# Altium schematic sheet Sheet1.SchDoc
size A1; SheetNumber: 2; SheetTotal: 4
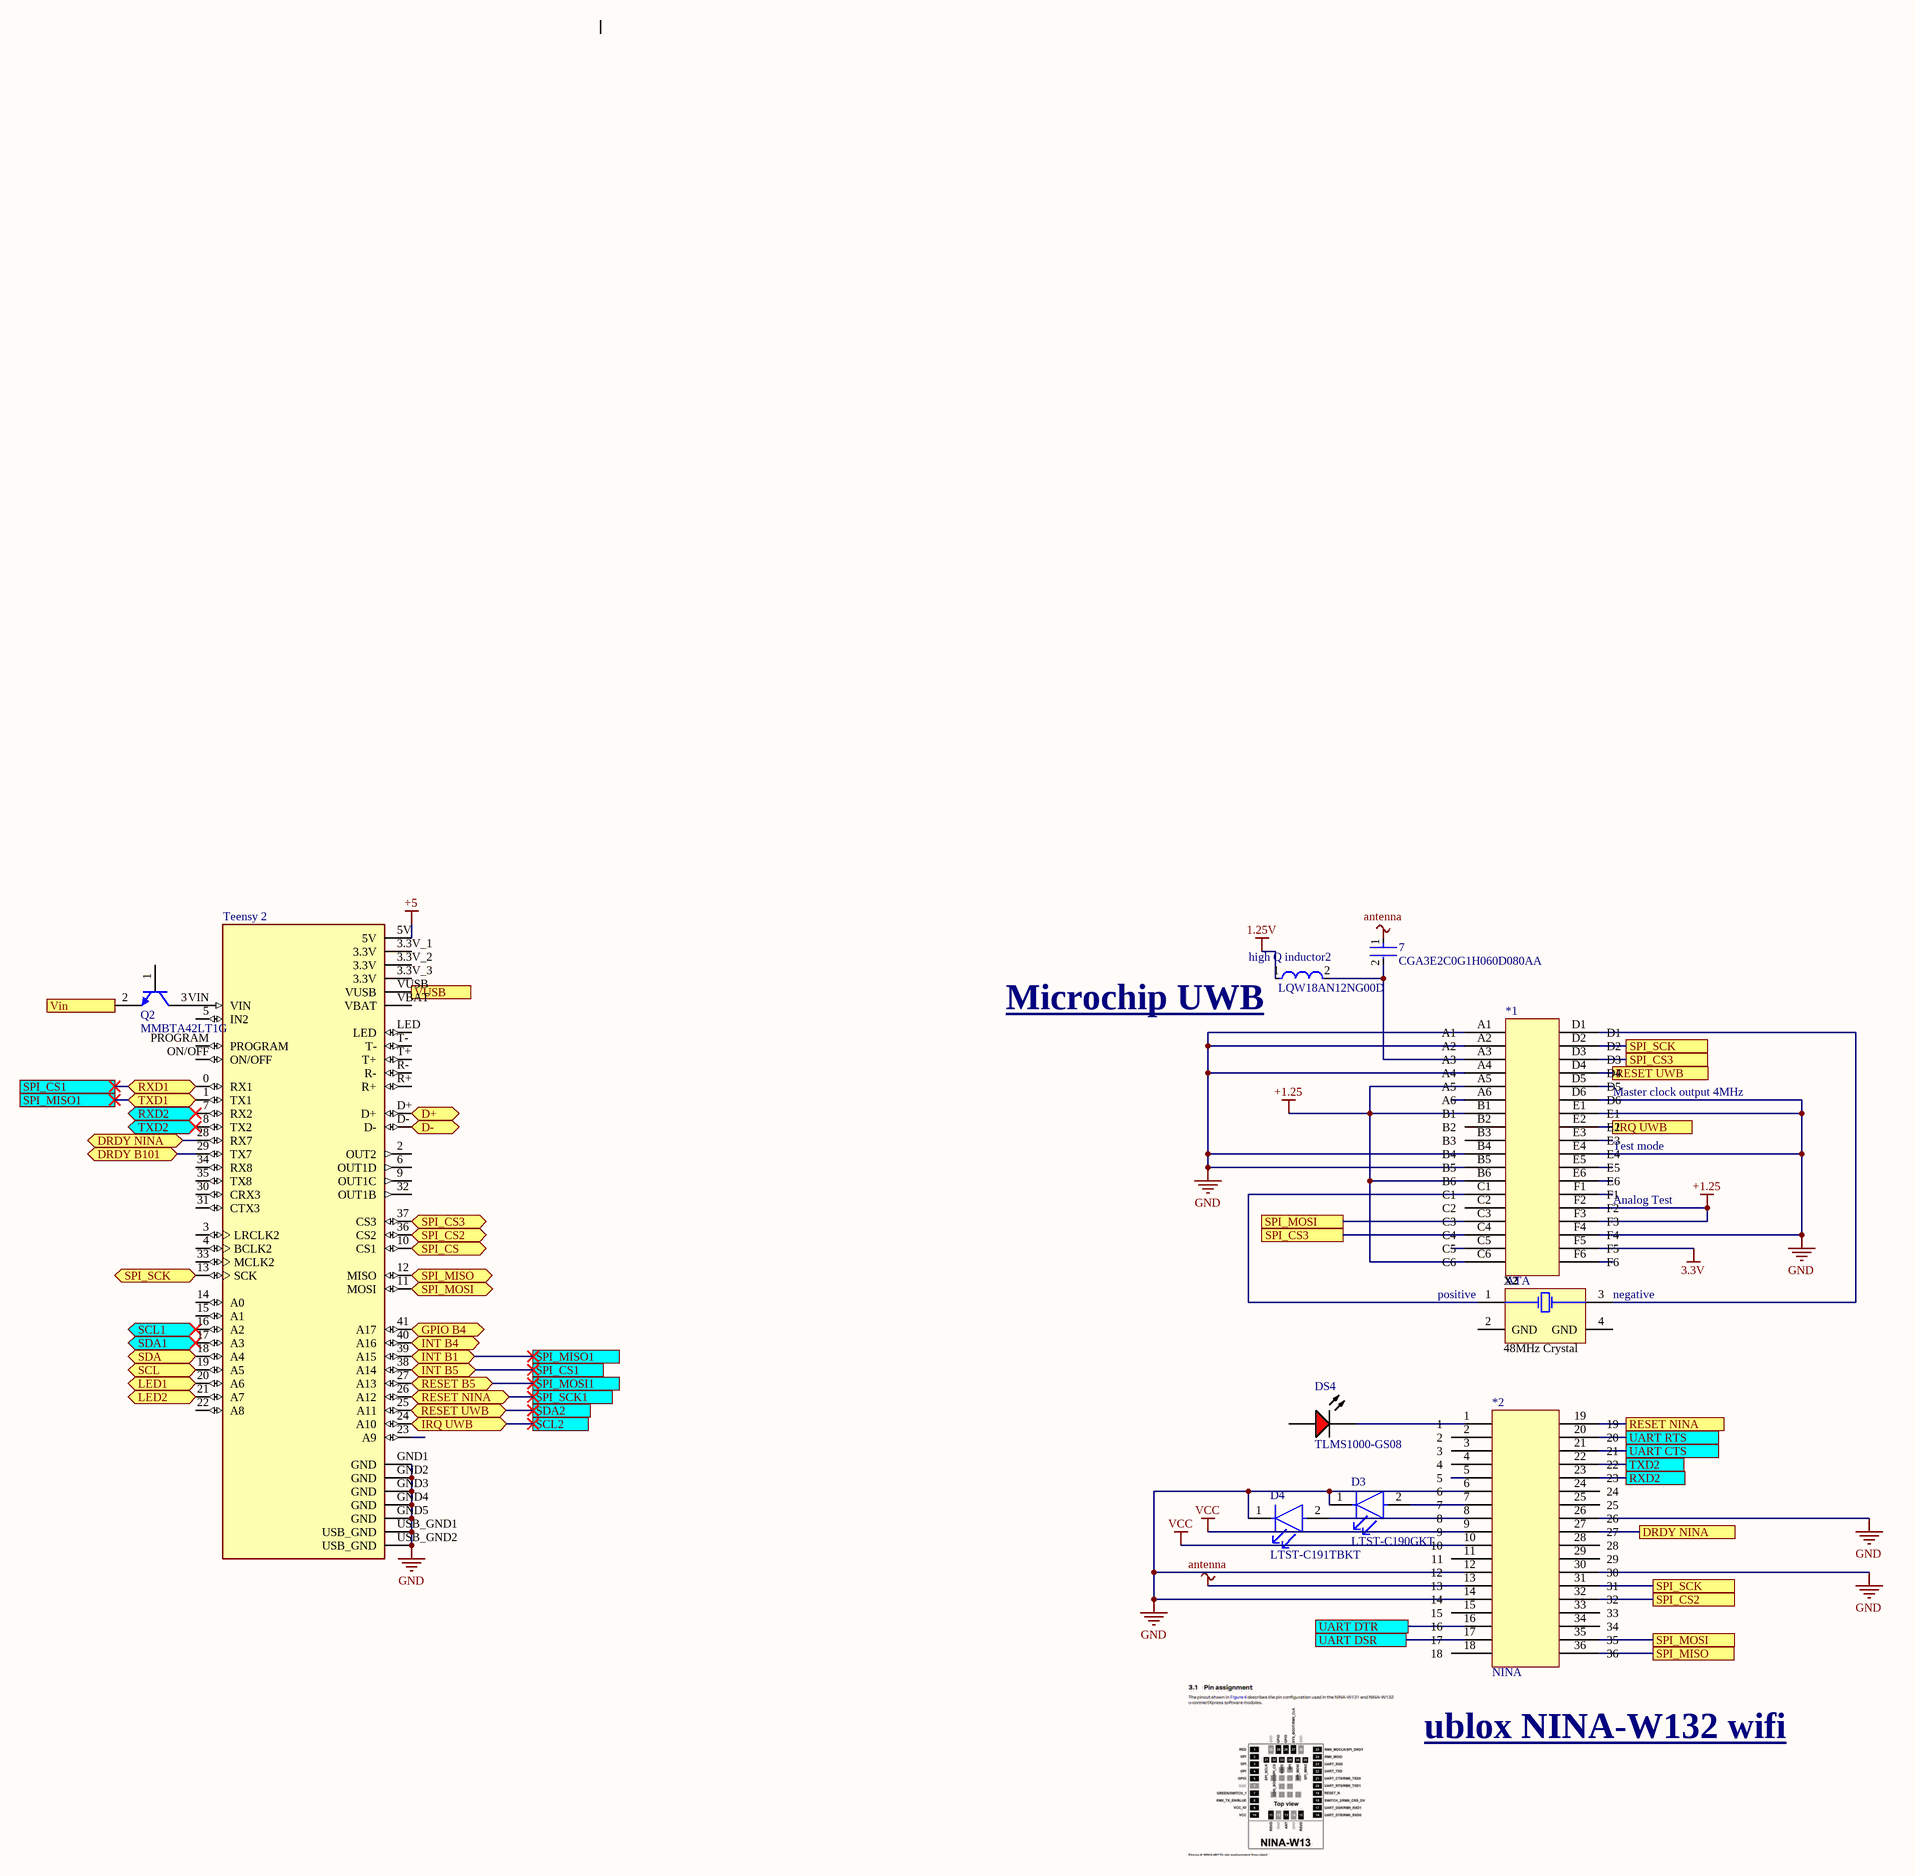
[diagram p0: Sheet1.SchDoc]

## Parts
7  CGA3E2C0G1H060D080AA  [FP-CGA3E-0_3-0_1-MFG]
*1  ATA  [ATA8350 - duplicate]
*2  NINA  [NINA-W131]
D3  LTST-C190GKT  [FP-LTST-C190GKT-MFG]
D4  LTST-C191TBKT  [FP-LTST-C191TBKT-MFG]
DS4  TLMS1000-GS08  [VISH-TLMS1000_V]
high_Q_inductor2  LQW18AN12NG00D  [FP-LQW18AN_00-MFG]
Q2  MMBTA42LT1G  [ONSC-SOT-23-3-318-08_V]
Teensy_2  Teensy 4.1  [MODULE_DEV-16771]  (value not drawn)
X2  48MHz Crystal  [ABRA-ABM3B-4_V]

## Ports
D+ (bidir), D- (bidir), DRDY B101 (bidir), DRDY NINA, DRDY NINA (bidir), GPIO B4 (bidir), INT B1 (bidir), INT B4 (bidir), INT B5 (bidir), IRQ UWB, IRQ UWB (bidir), LED1 (bidir), LED2 (bidir), RESET B5 (bidir), RESET NINA, RESET NINA (bidir), RESET UWB, RESET UWB (bidir), RXD1 (bidir), RXD2, RXD2 (bidir), SCL1 (bidir), SCL2, SCL (bidir), SDA1 (bidir), SDA2, SDA (bidir), SPI_CS1, SPI_CS2, SPI_CS2 (bidir), SPI_CS3, SPI_CS3 (bidir), SPI_CS (bidir), SPI_MISO, SPI_MISO1, SPI_MISO (bidir), SPI_MOSI, SPI_MOSI1, SPI_MOSI (bidir), SPI_SCK, SPI_SCK1, SPI_SCK (bidir), TXD1 (bidir), TXD2, TXD2 (bidir), UART CTS, UART DSR, UART DTR, UART RTS, Vin (in), VUSB

## Nets
1.25V: high_Q_inductor2.1
+5: Teensy_2.5V
antenna: 7.1
GND: D3.1(C) D4.1(C) Teensy_2.GND1(GND) Teensy_2.GND2(GND) Teensy_2.GND3(GND) Teensy_2.GND4(GND) Teensy_2.GND5(GND) Teensy_2.USB_GND1(USB_GND) Teensy_2.USB_GND2(USB_GND)
D+: Teensy_2.D+ ; port D+
D-: Teensy_2.D- ; port D-
DRDY B101: Teensy_2.29(TX7) ; port DRDY B101
DRDY NINA: Teensy_2.28(RX7) ; port DRDY NINA
GPIO B4: Teensy_2.41(A17) ; port GPIO B4
INT B1: Teensy_2.1(TX1) Teensy_2.39(A15) ; port SPI_MISO1, port INT B1, port TXD1
INT B4: Teensy_2.40(A16) ; port INT B4
INT B5: Teensy_2.0(RX1) Teensy_2.38(A14) ; port SPI_CS1, port INT B5, port RXD1
IRQ UWB: Teensy_2.24(A10) ; port SCL2, port IRQ UWB
LED1: Teensy_2.20(A6) ; port LED1
LED2: Teensy_2.21(A7) ; port LED2
RESET B5: Teensy_2.27(A13) ; port SPI_MOSI1, port RESET B5
RESET NINA: Teensy_2.26(A12) ; port RESET NINA, port SPI_SCK1
RESET UWB: port SDA2, port RESET UWB
RXD2: Teensy_2.7(RX2) ; port RXD2
SCL: Teensy_2.19(A5) ; port SCL
SCL1: Teensy_2.16(A2) ; port SCL1
SDA: Teensy_2.18(A4) ; port SDA
SDA1: Teensy_2.17(A3) ; port SDA1
SPI_CS: Teensy_2.10(CS1) ; port SPI_CS
SPI_CS2: Teensy_2.36(CS2) ; port SPI_CS2
SPI_CS3: Teensy_2.37(CS3) ; port SPI_CS3
SPI_MISO: Teensy_2.12(MISO) ; port SPI_MISO
SPI_MOSI: Teensy_2.11(MOSI) ; port SPI_MOSI
SPI_SCK: Teensy_2.13(SCK) ; port SPI_SCK
TXD2: Teensy_2.8(TX2) ; port TXD2
Vin: Q2.2(E) ; port Vin
VUSB: Teensy_2.VUSB ; port VUSB
Net7_2: 7.2 high_Q_inductor2.2
NetQ2_3: Q2.3(C) Teensy_2.VIN

Not connected (* = marked no-connect by the designer): *1 A1 A2 A3 A4 A5 A6 B1 B2 B3 B4 B5 B6 C1 C2 C3 C4 C5 C6 D1 D2 D3 D4 D5 D6 E1 E2 E3 E4 E5 E6 F1 F2 F3 F4 F5 F6; *2 1 2 3 4 5 6 7 8 9 10 11 12 13 14 15 16 17 18 19 20 21 22 23 24 25 26 27 28 29 30 31 32 33 34 35 36; D3 2(A); D4 2(A); DS4 1(A) 2(K); Q2 1(B); Teensy_2 2(OUT2) 3(LRCLK2) 3.3V_1(3.3V) 3.3V_2(3.3V) 3.3V_3(3.3V) 4(BCLK2) 5(IN2) 6(OUT1D) 9(OUT1C) 14(A0) 15(A1) 22(A8) 23(A9) 25(A11) 30(CRX3) 31(CTX3) 32(OUT1B) 33(MCLK2) 34(RX8) 35(TX8) LED ON/OFF PROGRAM R+ R- T+ T- VBAT; X2 1(X1) 2(GND) 3(X2) 4(GND)

## Notes on the sheet
- (near high_Q_inductor2) Microchip UWB
- (near *1) Master clock output 4MHz
- (near *1) Test mode
- (near *1) Analog Test
- positive
- negative
- ublox NINA-W132 wifi

## Library data of the parts
7 = CMP-08246-001317-1: Cap Ceramic 6pF 50V C0G 0.5pF Pad SMD 0603 +125°C Automotive T/R; Weight: 7.1E-05oz; Capacitance: 6pF; Min Operating Temperature: -55°C; Termination: SMD/SMT; Mount: Surface Mount; Thickness: 0.035inch; Voltage Rating: 50V; Case Code (Metric): 1608; Package Quantity: 1; Length: 1.6mm; Dielectric: C0G; REACH SVHC: No SVHC; Packaging: Tape and Reel; Height: 0.8mm; Composition: Ceramic; Depth: 0.8mm; Case Code (Imperial): 0603; Case/Package: 0603; Max Operating Temperature: 125°C; Voltage Rating (DC): 50V; Ratings: AEC-Q200; Width: 0.031inch
*1 *2 = Component_1
D3 = CMP-22017-000005-2: LED GREEN CLEAR CHIP SMD; Dominant Wavelength: 569nm; Reverse Voltage: 5V; Lens Color: Colorless; Viewing Angle: 130°; Voltage: 2V; Forward Current: 30mA; Power Dissipation: 100mW; Luminous Intensity: 6mcd; Number of LEDs: 1; Forward Voltage: 2.1V; Wavelength: 565nm; Test Current: 10mA; Min Operating Temperature: -55°C; Lens Style: Clear; Mount: Surface Mount; Width: 0.8mm; Packaging: Tape and Reel; Lens Transparency: Clear; Case Code (Metric): 1608; Depth: 0.8mm; Case Code (Imperial): 0603; Case/Package: 0603; Number of Pins: 2; Max Operating Temperature: 85°C; Lead Free: Lead Free; Number of Elements: 1; Length: 1.6mm; Height: 0.8mm; Package Quantity: 1; Power Rating: 100mW; Radiation Hardening: No; Illumination Color: Green; Color: Green
D4 = CMP-22017-000008-1: LED BLUE CLEAR CHIP SMD; Lens Color: Colorless; Dominant Wavelength: 475nm; Forward Current: 20mA; Wavelength: 468nm; Viewing Angle: 130°; Power Dissipation: 76mW; Luminous Intensity: 180mcd; Reverse Voltage: 5V; Number of Elements: 1; Lens Style: Diffused; Forward Voltage: 3.8V; Max Power Dissipation: 75mW; Case Code (Metric): 1608; Packaging: Tape and Reel; Case/Package: 0603; Depth: 1.6mm; Mount: Surface Mount; Lead Free: Lead Free; Min Operating Temperature: -20°C; Lens Transparency: Clear; Illumination Color: Blue; Height: 0.55mm; Test Current: 20mA; Case Code (Imperial): 0603; Max Operating Temperature: 80°C; Number of Pins: 2; Length: 0.8mm; Radiation Hardening: No; Package Quantity: 1; Number of LEDs: 1; Width: 0.8mm; Color: Blue
DS4 = CMP-2000-07254-1: Low Current LED, 40 mW, 1.8 V, -40 to 100 degC, 2-Pin SMD (0603), RoHS, Tape and Reel; Manufacturer: Vishay; Lens Shape: Rectangular; Automotive Qualification Standard: AEC-Q100; Wavelength Typ: 636nm; SVHC: ToBeAdvised; LED Colour: Red; Bulb Size: 1.6mmx0.8mm; Forward Voltage: 1.8V; Luminous Intensity: 4mcd; Forward Current If: 2mA; Viewing Angle: 80°; Datasheet Version: Rev. 1.7, 02/2011; Datasheet URL: https://datasheet.ciiva.com/5798/1698881-5798337.pdf; LED Mounting: SMD; Packaging: CutTape; Package Reference: TLMS1000; Manufacturer URL: http://www.vishay.com/; Mounting Technology: SurfaceMount; Product Range: -; Package Description: 2-Pin Surface Mount Device, Body 1.6 x 0.8 mm; MSL: MSL2-1year
high_Q_inductor2 = CMP-06042-001615-1: Wire Wound RF Inductor 12nH ±2% 600mA 0.13Ω 0603 (1608); Test Frequency: 100MHz; Series Resistance: 130mR; Self Resonant Frequency: 6GHz; Current: 500mA; Shielding: Unshielded; Q Factor: 35; Inductance: 12nH; Case Code (Metric): 1608; Case/Package: 0603; Max Operating Temperature: 125°C; Height: 0.8mm; Case Code (Imperial): 0603; Min Operating Temperature: -55°C; Radiation Hardening: No; Width: 0.8mm; Package Quantity: 4000; Number of Pins: 2; Tolerance: 2%; Lead Free: Lead Free; Termination: SMD/SMT; DC Resistance (DCR): 130mR; Packaging: Tape and Reel; Inductance Tolerance: 2%; Current Rating: 600mA; Weight: 0.000106oz; Length: 1.6mm; REACH SVHC: No SVHC; DC Current: 600mA; Depth: 1mm; Military Standard: Not; Max DC Current: 600mA; Resistor Type: Wirewound; Mount: Surface Mount
Q2 = CMP-1048-00662-1: High Voltage Transistor, NPN Silicon, 3-Pin SOT-23, Pb-Free, Tape and Reel; Manufacturer: On Semiconductor; fT Min (MHz): 50; IC Continuous (A): 0.5; ComponentLink1URL: http://www.onsemi.com/; ComponentLink3URL: http://www.onsemi.cn/pub_link/Collateral/318-08.PDF; RoHS: TRUE; ComponentLink2Description: Datasheet; PartNumber: MMBTA42LT1G; Polarity: NPN; DatasheetVersion: Rev. 12; PackageReference: SOT-23-3-318-08; PackageDescription: 3-Pin Small Outline Transistor, Body 2.92 x 1.3 mm, Pitch 0.95 mm; ComponentLink3Description: Package Specification; ComponentLink1Description: Manufacturer URL; Packing: Tape and Reel; PackageVersion: Rev. AP, 11/2009; Mounting Technology: Surface Mount; ComponentLink2URL: http://www.onsemi.cn/pub_link/Collateral/MMBTA42LT1-D.PDF
Teensy_2 = CMP-003-000000-1: RT1062 Teensy 4.1 series ARMÂ® CortexÂ®-M7 MPU Embedded Evaluation Board; MF: SparkFun Electronics; MP: DEV-16771; Package: None; Component Type: Standard; Pin Count: 65; Purchase-URL: https://pricing.snapeda.com/search/part/DEV-16771/?ref=eda; SnapEDA_Link: https://www.snapeda.com/parts/DEV-16771/SparkFun+Electronics/view-part/?ref=snap; Availability: In Stock; Source: DEV-16771.SchLib; Design Item ID: DEV-16771; Check_prices: https://www.snapeda.com/parts/DEV-16771/SparkFun+Electronics/view-part/?ref=eda; Value: *; Price: None
X2 = CMP-003-00019-2: Ceramic SMD Crystal, 24 MHz, +/- 20 ppm, 18 pF, -20 to 70 degC, 4-Pin SMD, RoHS, Tape and Reel; Manufacturer: Abracon; Load Capacitance: 18pF; Frequency Tolerance: 20ppm; ESR: 50; Resistance: 50Ohm; Frequency: 24MHz; Package Quantity: 1000; Packaging: TapeandReel; RoHS Compliant: True; Package Description: 4-Pin Surface Mount Device, Body 5 x 3.2 mm; Mounting Technology: SM; Pins: 4; Datasheet URL: http://www.abracon.com/Resonators/abm3b.pdf; Tolerance: 20ppm; Manufacturer URL: http://www.abracon.com/; Max Operating Temperature: 70°C; Datasheet Version: Aug-15; Min Operating Temperature: -20°C; Package Reference: ABM3B; Case/Package: CSMD